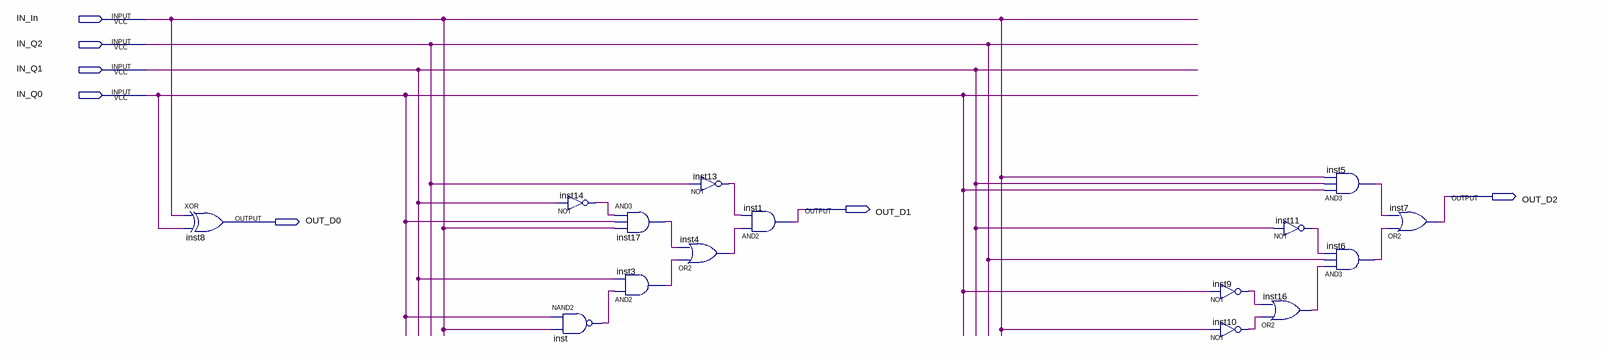
[diagram p0: schematic sheet]
// Quartus schematic FuncionDeEstado.bdf as structural Verilog: 15 symbols, 7 pins
module FuncionDeEstado (
  input  IN_In,
  input  IN_Q2,
  input  IN_Q1,
  input  IN_Q0,
  output OUT_D2,
  output OUT_D1,
  output OUT_D0
);

  wire inst3_out, inst4_out, inst5_out, inst6_out, inst9_out, inst10_out, inst11_out, inst13_out, inst14_out,
       inst16_out, inst17_out, inst_out;

  xor inst8 (OUT_D0, IN_In, IN_Q0);
  nand inst (inst_out, IN_Q0, IN_In);
  not inst14 (inst14_out, IN_Q1);
  and inst17 (inst17_out, inst14_out, IN_Q0, IN_In);
  and inst3 (inst3_out, inst_out, IN_Q1);
  not inst13 (inst13_out, IN_Q2);
  or inst4 (inst4_out, inst3_out, inst17_out);
  and inst1 (OUT_D1, inst4_out, inst13_out);
  not inst9 (inst9_out, IN_Q0);
  not inst10 (inst10_out, IN_In);
  or inst16 (inst16_out, inst10_out, inst9_out);
  not inst11 (inst11_out, IN_Q1);
  and inst5 (inst5_out, IN_Q0, IN_Q1, IN_In);
  and inst6 (inst6_out, inst16_out, IN_Q2, inst11_out);
  or inst7 (OUT_D2, inst6_out, inst5_out);
endmodule
